# Altium schematic sheet obc-v2_CM4-M2.SchDoc
size 420 x 297 mm; SheetNumber: 13; SheetTotal: 21
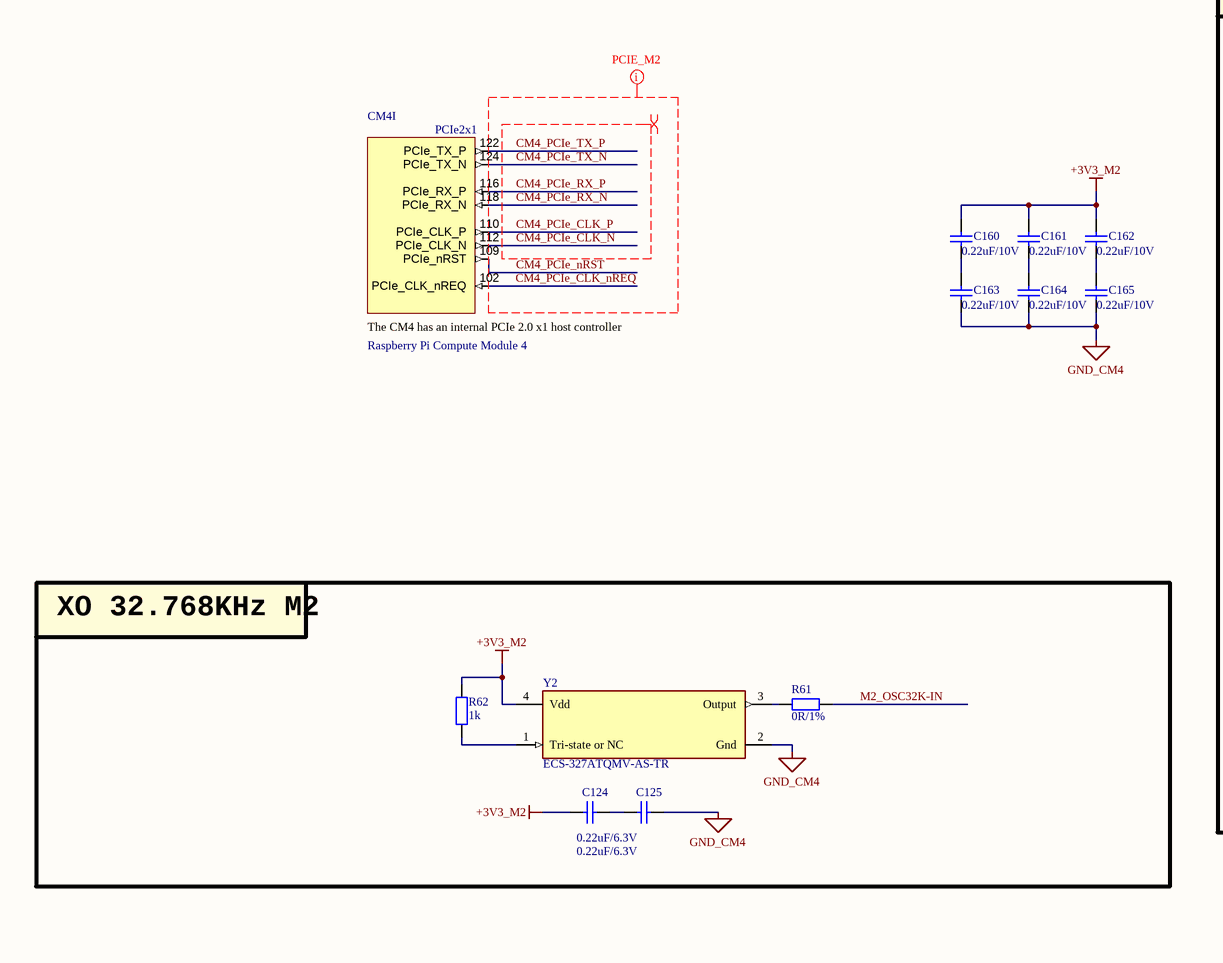
[diagram p0: obc-v2_CM4-M2.SchDoc, left]
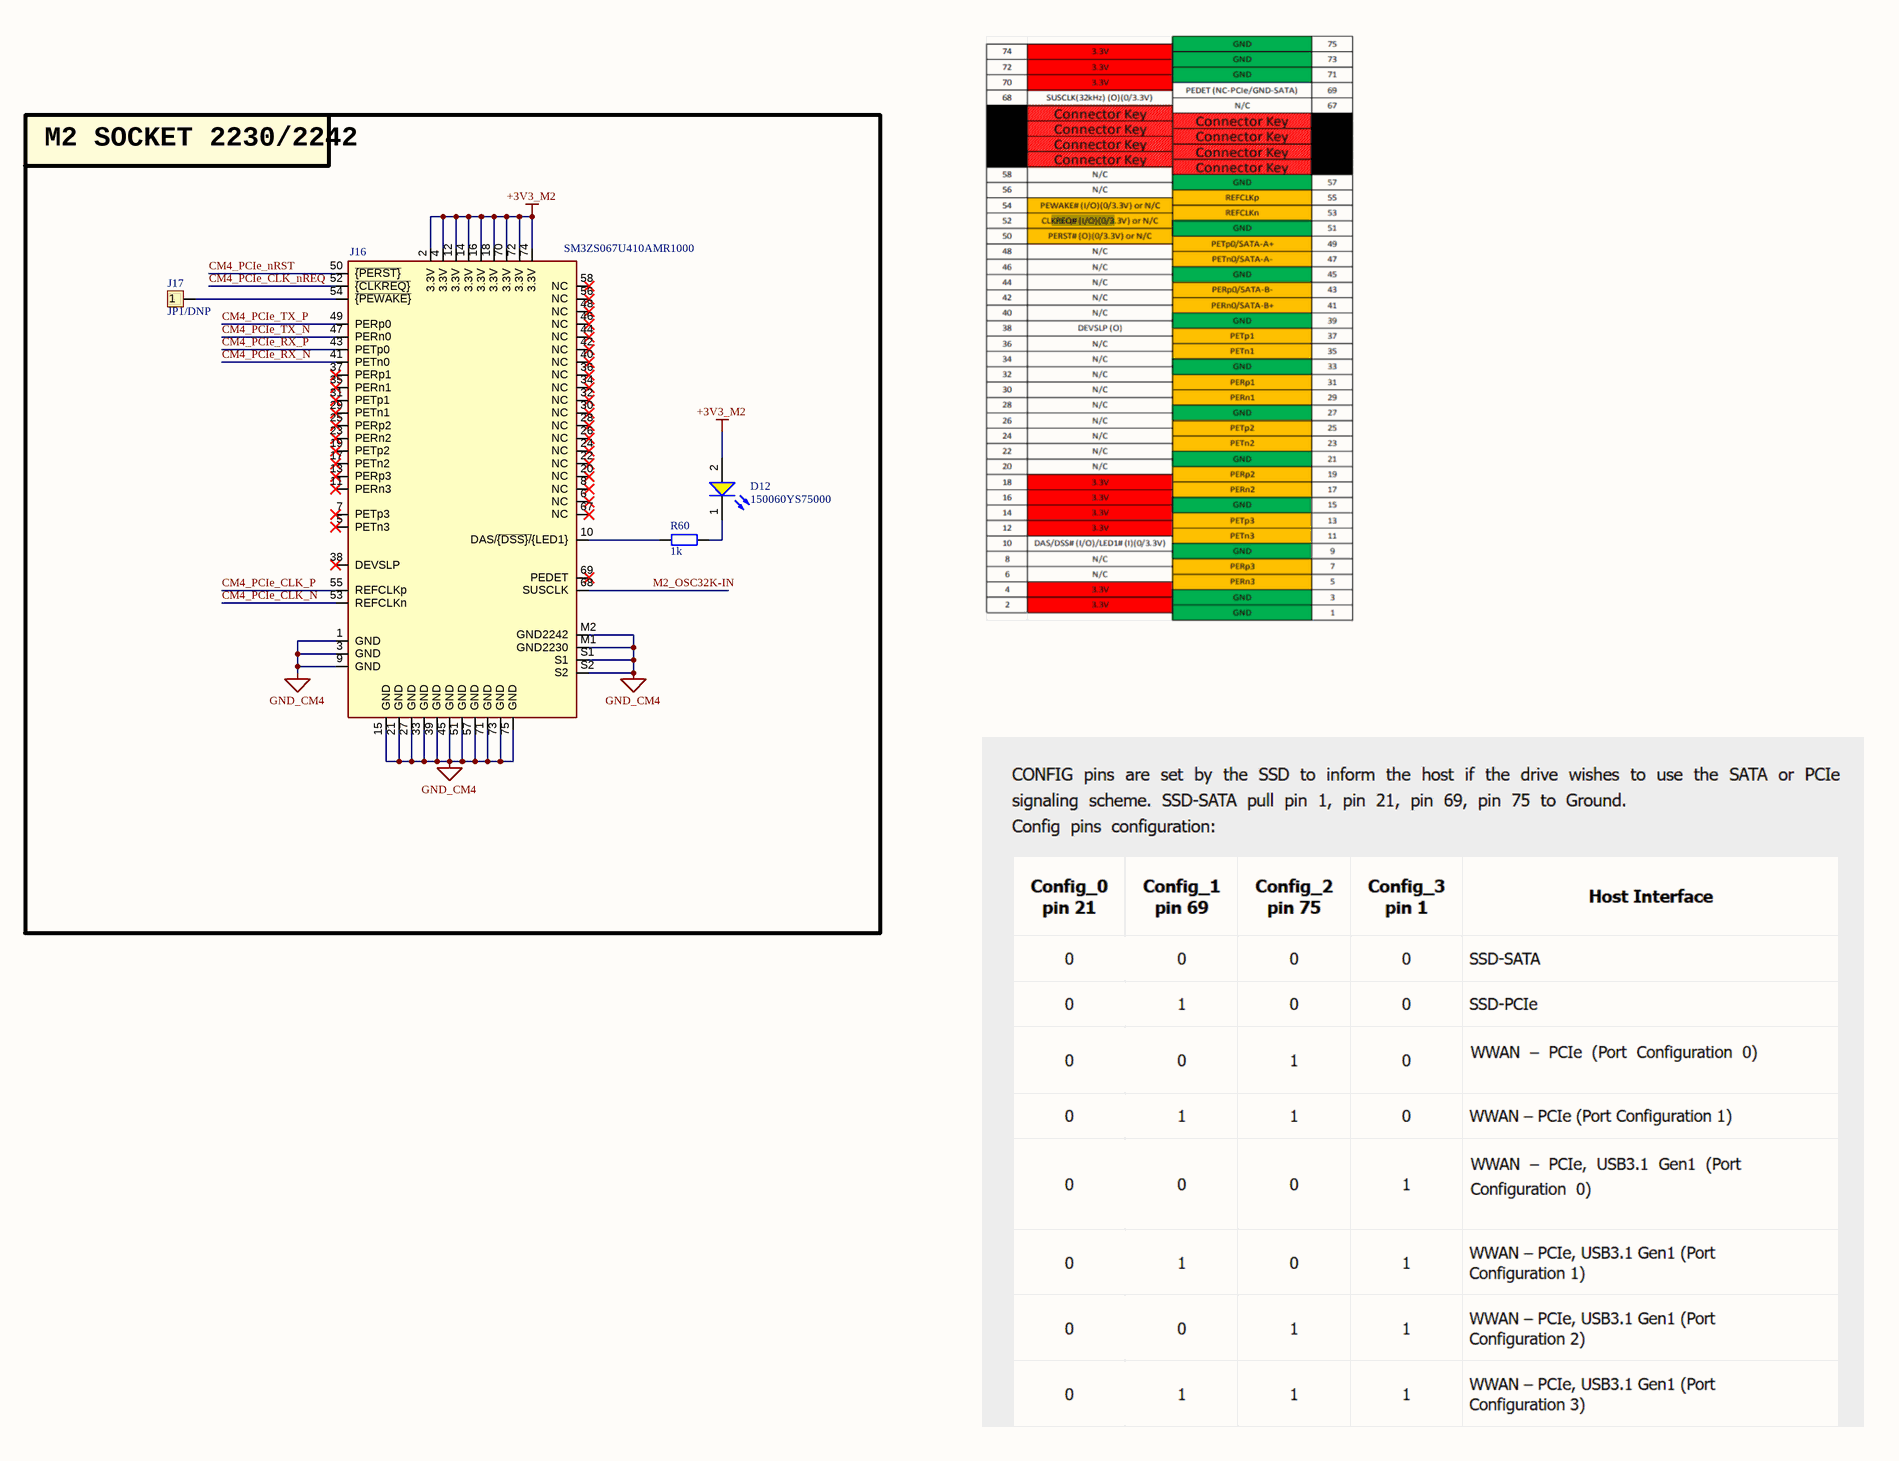
[diagram p1: obc-v2_CM4-M2.SchDoc, right]

## Parts
C124  0.22uF/6.3V  [CAP_C_1005X60]
C125  0.22uF/6.3V  [CAP_C_1005X60]
C160  0.22uF/10V  [CAP_C_1005X60]
C161  0.22uF/10V  [CAP_C_1005X60]
C162  0.22uF/10V  [CAP_C_1005X60]
C163  0.22uF/10V  [CAP_C_1005X60]
C164  0.22uF/10V  [CAP_C_1005X60]
C165  0.22uF/10V  [CAP_C_1005X60]
CM4  Raspberry Pi Compute Module 4  [CM4-DF40HC(3.0)-100DS-0.4v_3mm_1.5mm]  (part I of 21)  (no BOM)
D12  150060YS75000  [WL-SMCW_0603_150060xx75000]
J16  value SM3ZS067U410AMR1000  [M.2 M Key socket]  (hidden comment: Bus_M.2_Socket_M)
J17  JP1/DNP  [JP1-D1T]
R60  1k  [RES_C_1608X60]
R61  0R/1%  [RES_C_1608X60]
R62  1k  [RES_C_1608X60]
Y2  ECS-327ATQMV-AS-TR  [FP-327ATQMV-MFG]

## Blocks framed on the sheet
M2 SOCKET 2230/2242: D12 J16 J17 R60
XO 32.768KHz M2: C124 C125 R61 R62 Y2

## Nets
+3V3_M2: C124.1 C160.1 C161.1 C162.1 D12.2(A) J16.2(3.3V) J16.4(3.3V) J16.12(3.3V) J16.14(3.3V) J16.16(3.3V) J16.18(3.3V) J16.70(3.3V) J16.72(3.3V) J16.74(3.3V) R62.1 Y2.4(Vdd)
GND_CM4: C125.2 C163.2 C164.2 C165.2 J16.1(GND) J16.3(GND) J16.9(GND) J16.15(GND) J16.21(GND) J16.27(GND) J16.33(GND) J16.39(GND) J16.45(GND) J16.51(GND) J16.57(GND) J16.71(GND) J16.73(GND) J16.75(GND) J16.M1(GND2230) J16.M2(GND2242) J16.S1 J16.S2 Y2.2(Gnd)
CM4_PCIe_CLK_N: CM4.112(PCIe_CLK_N) J16.53(REFCLKn)
CM4_PCIe_CLK_nREQ: CM4.102(PCIe_CLK_nREQ) J16.52(~{{CLKREQ}})
CM4_PCIe_CLK_P: CM4.110(PCIe_CLK_P) J16.55(REFCLKp)
CM4_PCIe_nRST: CM4.109(PCIe_nRST) J16.50(~{{PERST}})
CM4_PCIe_RX_N: CM4.118(PCIe_RX_N) J16.41(PETn0)
CM4_PCIe_RX_P: CM4.116(PCIe_RX_P) J16.43(PETp0)
CM4_PCIe_TX_N: CM4.124(PCIe_TX_N) J16.47(PERn0)
CM4_PCIe_TX_P: CM4.122(PCIe_TX_P) J16.49(PERp0)
M2_OSC32K-IN: J16.68(SUSCLK) R61.1
NetC124_2: C124.2 C125.1
NetC160_2: C160.2 C163.1
NetC161_2: C161.2 C164.1
NetC162_2: C162.2 C165.1
NetD12_1: D12.1(K) R60.1
NetJ16_10: J16.10(DAS/~{{DSS}/}{LED1}) R60.2
NetJ16_54: J16.54(~{{PEWAKE}}) J17.1
NetR61_2: R61.2 Y2.3(Output)
NetR62_2: R62.2 Y2.1(Tri-state_or_NC)

Not connected (* = marked no-connect by the designer): J16 5(PETn3)* 6(NC)* 7(PETp3)* 8(NC)* 11(PERn3)* 13(PERp3)* 17(PETn2)* 19(PETp2)* 20(NC)* 22(NC)* 23(PERn2)* 24(NC)* 25(PERp2)* 26(NC)* 28(NC)* 29(PETn1)* 30(NC)* 31(PETp1)* 32(NC)* 34(NC)* 35(PERn1)* 36(NC)* 37(PERp1)* 38(DEVSLP)* 40(NC)* 42(NC)* 44(NC)* 46(NC)* 48(NC)* 56(NC)* 58(NC)* 67(NC)* 69(PEDET)*

## Layout directives
differential pair; differential pair class DIFF100: CM4_PCIe_CLK_N, CM4_PCIe_CLK_P, CM4_PCIe_RX_N, CM4_PCIe_RX_P, CM4_PCIe_TX_N, CM4_PCIe_TX_P
net class PCIE_M2: CM4_PCIe_CLK_N, CM4_PCIe_CLK_nREQ, CM4_PCIe_CLK_P, CM4_PCIe_nRST, CM4_PCIe_RX_N, CM4_PCIe_RX_P, CM4_PCIe_TX_N, CM4_PCIe_TX_P

## Notes on the sheet
- Project:
- Sub-system:
- Design by:
- Sheet title:
- Sheet
- A3
- of
- Checked by:
- Approved by:
- Revision:
- Document No:
- Size:
- Date:
- (in symbol CM4, part I) PCIe2x1; The CM4 has an internal PCIe 2.0 x1 host controller

## Library data of the parts
C124 C125 C160-C165 = Tu 0402 33nF 10V: CAPC; Chung_Loai: Dán; Don_Vi: Con; So_Chan: 2; Ten_Linh_Kien: Tụ 0402 33nF X7R 10V GRM155R71A333KA01D; Ma_Hang: MH007853; Kieu_Chan: *
CM4 = CM4: Raspberry Pi Compute Module 4 by Amornthep Phunsin
D12 = CMP-1426-00005-2: LED YELLOW CLEAR 0603 SMD; NexarPartId: 29687085; Wavelength: 590nm; Luminous Intensity: 120mcd; Peak Wavelength: 595nm; Forward Current: 100mA; Power Dissipation: 72mW; Forward Voltage: 2V; Test Current: 20mA; Reverse Voltage: 5V; Lens Style: Clear, Rectangular; Max Junction Temperature (Tj): 95°C; Viewing Angle: 140°; Case Code (Imperial): 0603; Height: 700µm; REACH SVHC: Unknown; Dominant Wavelength: 590nm; Min Operating Temperature: -40°C; Color: Yellow; Width: 800µm; Mount: Surface Mount; Packaging: Tape and Reel; Max Operating Temperature: 85°C; RoHS: Compliant; Max Reverse Voltage (DC): 5V; Case Code (Metric): 1608; Length: 1.6mm; Case/Package: 0603
J16 = Bus_M.2_Socket_M: Part Description: M.2 M Key connector; Field5: MTSSD03-67MSW337; Field7: MTCONN; Field6: MTSSD03-67MSW337; Footprint: CM5IO:M.2 M Key socket
J17 = JP1: WR-PHD 2.54 mm Angled Socket Header; Manufacturer: W¨¹rth Elektronik eiSos GmbH; partNo: 613002143121; ComponentLink1 Description: Manufacturer; ComponentLink2 Description: Datasheet; NoPins: 02; Created Date: 29 March 2013; ComponentLink1URL: http://www.we-online.com; ComponentLink2URL: http://katalog.we-online.de/em/datasheet/6130xx143121.pdf; Created by: Karrer Zheng
R60-R62 = Tro 0603 1% 10k: RES; Chung_Loai: Dán; Don_Vi: Con; So_Chan: 2; Ten_Linh_Kien: Trở 0603 1% 10k; Ma_Hang: MH006333; Kieu_Chan: *
Y2 = CMP-40224-000027-1: XTAL OSC XO 32.7680KHZ CMOS SMD; RoHS Compliant: Yes